# EAGLE design tiny-ui (EAGLE 5.10)
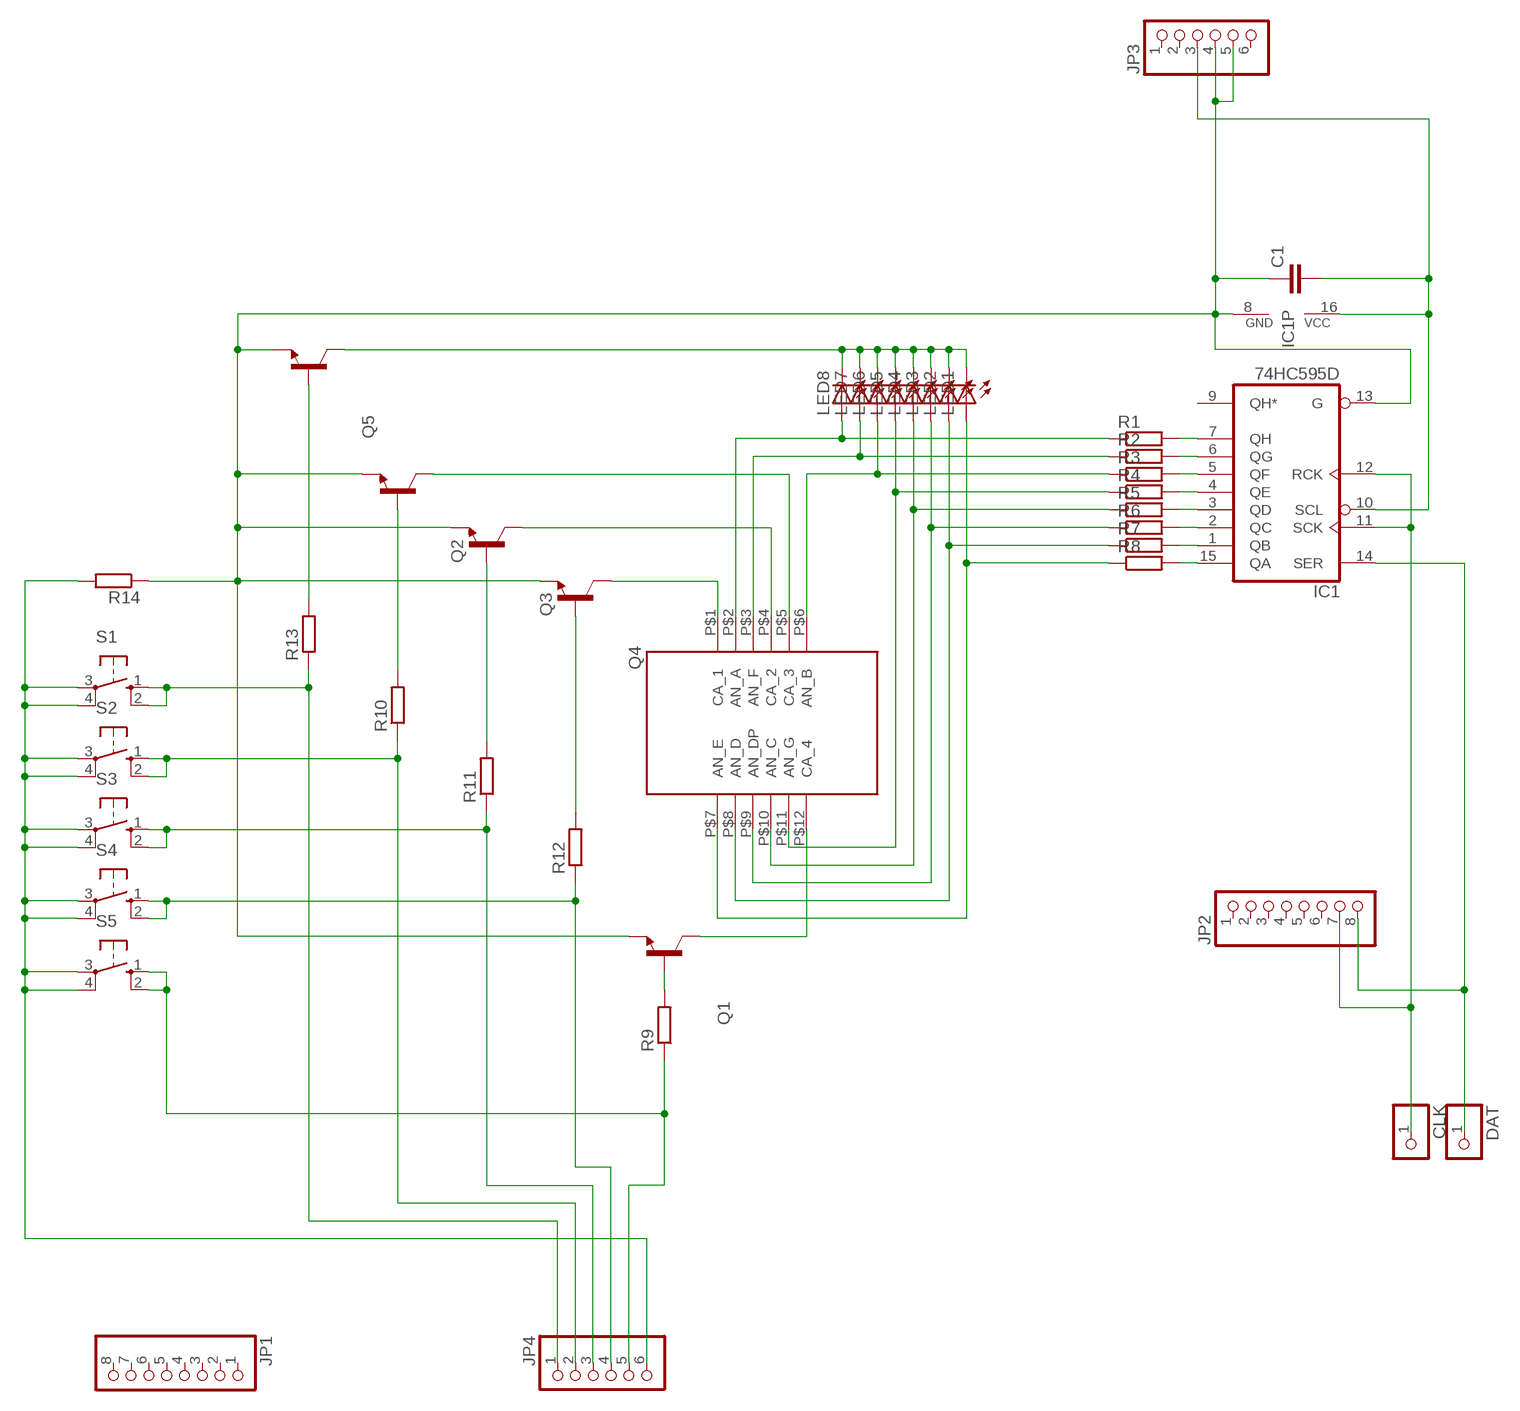
[diagram p0: schematic, sheet 1]

## Parts
C1  C-EUC0805  [C0805]
CLK  HEADER-1X1  [1X01_OVAL]
DAT  HEADER-1X1  [1X01_OVAL]
DISP1  QUAD7SEG  [QUAD7SEG]
IC1  74HC595D  [SO16]
JP1  PINHD-1X8  [1X08]
JP2  PINHD-1X8  [1X08]
JP3  PINHD-1X6  [1X06]
JP4  PINHD-1X6  [1X06]
LED1  LED3MM  [LED3MM]
LED2  LED3MM  [LED3MM]
LED3  LED3MM  [LED3MM]
LED4  LED3MM  [LED3MM]
LED5  LED3MM  [LED3MM]
LED6  LED3MM  [LED3MM]
LED7  LED3MM  [LED3MM]
LED8  LED3MM  [LED3MM]
Q1  MMBT2222ALT1-NPN-SOT23-BEC  [SOT23-BEC]
Q2  MMBT2222ALT1-NPN-SOT23-BEC  [SOT23-BEC]
Q3  MMBT2222ALT1-NPN-SOT23-BEC  [SOT23-BEC]
Q4  MMBT2222ALT1-NPN-SOT23-BEC  [SOT23-BEC]
Q5  MMBT2222ALT1-NPN-SOT23-BEC  [SOT23-BEC]
R1  R-EU_R0805  [R0805]
R2  R-EU_R0805  [R0805]
R3  R-EU_R0805  [R0805]
R4  R-EU_R0805  [R0805]
R5  R-EU_R0805  [R0805]
R6  R-EU_R0805  [R0805]
R7  R-EU_R0805  [R0805]
R8  R-EU_R0805  [R0805]
R9  R-EU_R0805  [R0805]
R10  R-EU_R0805  [R0805]
R11  R-EU_R0805  [R0805]
R12  R-EU_R0805  [R0805]
R13  R-EU_R0805  [R0805]
R14  R-EU_R0805  [R0805]
S1  10-XX  [B3F-10XX]
S2  10-XX  [B3F-10XX]
S3  10-XX  [B3F-10XX]
S4  10-XX  [B3F-10XX]
S5  10-XX  [B3F-10XX]

## Nets
GND: C1.1 IC1.8(GND) IC1.13(G) JP3.4 JP3.5 Q1.E Q2.E Q3.E Q4.E Q5.E R14.1
N$1: IC1.7(QH) R1.2
N$2: IC1.6(QG) R2.2
N$3: IC1.5(QF) R3.2
N$4: IC1.4(QE) R4.2
N$5: IC1.3(QD) R5.2
N$6: IC1.2(QC) R6.2
N$7: IC1.1(QB) R7.2
N$8: IC1.15(QA) R8.2
N$9: DISP1.P$2(AN_A) LED8.A R1.1
N$10: DISP1.P$3(AN_F) LED7.A R2.1
N$11: DISP1.P$6(AN_B) LED6.A R3.1
N$12: DISP1.P$11(AN_G) LED5.A R4.1
N$13: DISP1.P$10(AN_C) LED4.A R5.1
N$14: DISP1.P$9(AN_DP) LED3.A R6.1
N$15: DISP1.P$8(AN_D) LED2.A R7.1
N$16: DISP1.P$7(AN_E) LED1.A R8.1
N$17: LED1.K(C) LED2.K(C) LED3.K(C) LED4.K(C) LED5.K(C) LED6.K(C) LED7.K(C) LED8.K(C) Q5.C
N$18: DISP1.P$1(CA_1) Q4.C
N$19: DISP1.P$4(CA_2) Q3.C
N$20: DISP1.P$5(CA_3) Q2.C
N$21: DISP1.P$12(CA_4) Q1.C
N$22: Q5.B R13.2
N$23: Q2.B R10.2
N$24: Q3.B R11.2
N$25: Q4.B R12.2
N$26: Q1.B R9.2
N$28: CLK.1 IC1.11(SCK) IC1.12(RCK) JP2.7
N$31: JP4.1 R13.1 S1.1(S) S1.2(S1)
N$32: JP4.2 R10.1 S2.1(S) S2.2(S1)
N$33: JP4.3 R11.1 S3.1(S) S3.2(S1)
N$34: JP4.4 R12.1 S4.1(S) S4.2(S1)
N$35: JP4.6 R14.2 S1.3(P) S1.4(P1) S2.3(P) S2.4(P1) S3.3(P) S3.4(P1) S4.3(P) S4.4(P1) S5.3(P) S5.4(P1)
N$36: JP4.5 R9.1 S5.1(S) S5.2(S1)
N$37: DAT.1 IC1.14(SER) JP2.8
VCC: C1.2 IC1.10(SCL) IC1.16(VCC) JP3.3
Unconnected: IC1.9(QH*) JP1.1 JP1.2 JP1.3 JP1.4 JP1.5 JP1.6 JP1.7 JP1.8 JP2.1 JP2.2 JP2.3 JP2.4 JP2.5 JP2.6 JP3.1 JP3.2 JP3.6

## Library data of the parts
C1 = rcl:C-EU: CAPACITOR, European symbol
CLK DAT = microbuilder:HEADER-1X1: PIN HEADER
DISP1 = jasons_stuff:QUAD7SEG
IC1 = 74xx-eu:74*595: 8-bit SHIFT REGISTER, output latch
JP1 JP2 = pinhead:PINHD-1X8: PIN HEADER
JP3 JP4 = pinhead:PINHD-1X6: PIN HEADER
LED1-LED8 = adafruit:LED: LED OSRAM: - CHIPLED LG R971, LG N971, LY N971, LG Q971, LY Q971, LO R971, LY R971 LH N974, LH R974 LS Q976, LO Q976, LY Q976 LO Q996 - Hyper CHIPLED LW Q18S LB Q993, LB Q99A, LB R99A - SideLED LS A670, LO A670, LY A670, LG A670, LP A670 LB A673, LV A673, LT A673, LW A673 LH A674 LY A675 LS A676, LA A676, LO A676, LY A676, LW A676 LS A679, LY A679, LG A679 - Hyper Micro SIDELED® LS Y876, LA Y876, LO Y876, LY Y876 LT Y87S - SmartLED LW L88C, LW L88S LB L89C, LB L89S, LG L890 LS L89K, LO L89K, LY L89K LS L896, LA L896, LO L896, LY L896 - TOPLED LS T670, LO T670, LY T670, LG T670, LP T670 LSG T670, LSP T670, LSY T670, LOP T670, LYG T670 LG T671, LOG T671, LSG T671 LB T673, LV T673, LT T673, LW T673 LH T674 LS T676, LA T676, LO T676, LY T676, LB T676, LH T676, LSB T676, LW T676 LB T67C, LV T67C, LT T67C, LS T67K, LO T67K, LY T67K, LW E67C LS E67B, LA E67B, LO E67B, LY E67B, LB E67C, LV E67C, LT E67C LW T67C LS T679, LY T679, LG T679 LS T770, LO T770, LY T770, LG T770, LP T770 LB T773, LV T773, LT T773, LW T773 LH T774 LS E675, LA E675, LY E675, LS T675 LS T776, LA T776, LO T776, LY T776, LB T776 LHGB T686 LT T68C, LB T68C - Hyper Mini TOPLED® LB M676 - Mini TOPLED Santana® LG M470 LS M47K, LO M47K, LY M47K Source: http://www.osram.convergy.de/
Q1-Q5 = transistor:*-NPN-: NPN Transistror BF959 corrected 2008.03.06
R1-R14 = rcl:R-EU_: RESISTOR, European symbol
S1-S5 = switch-omron:10-XX: OMRON SWITCH

## Board
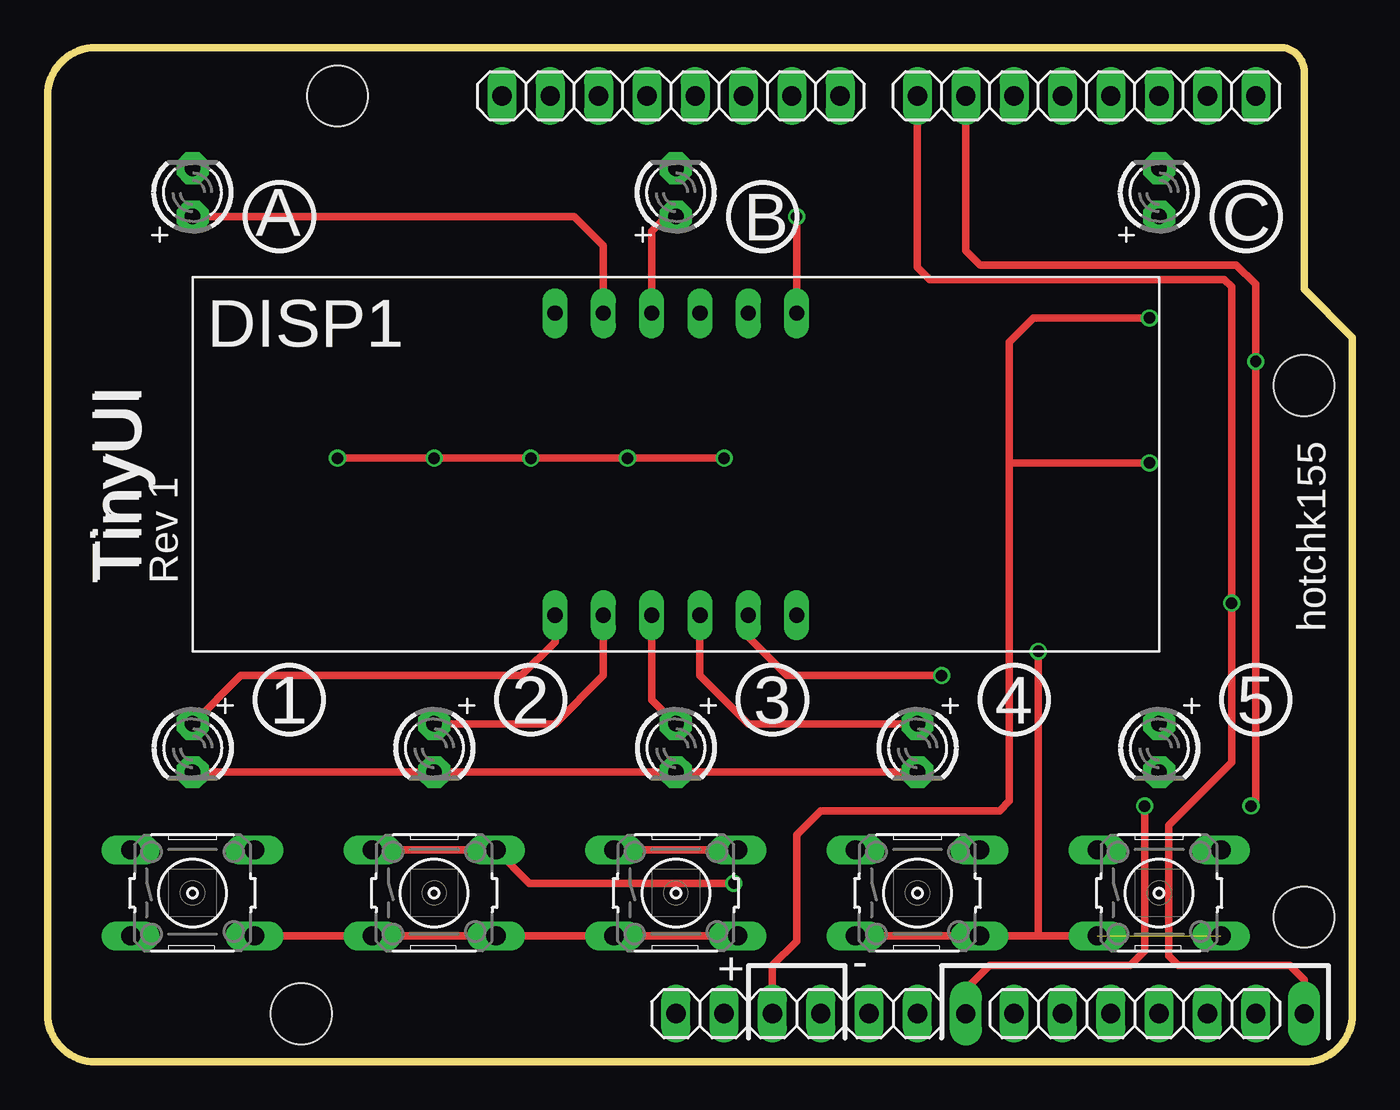
[diagram p1: board, top side]
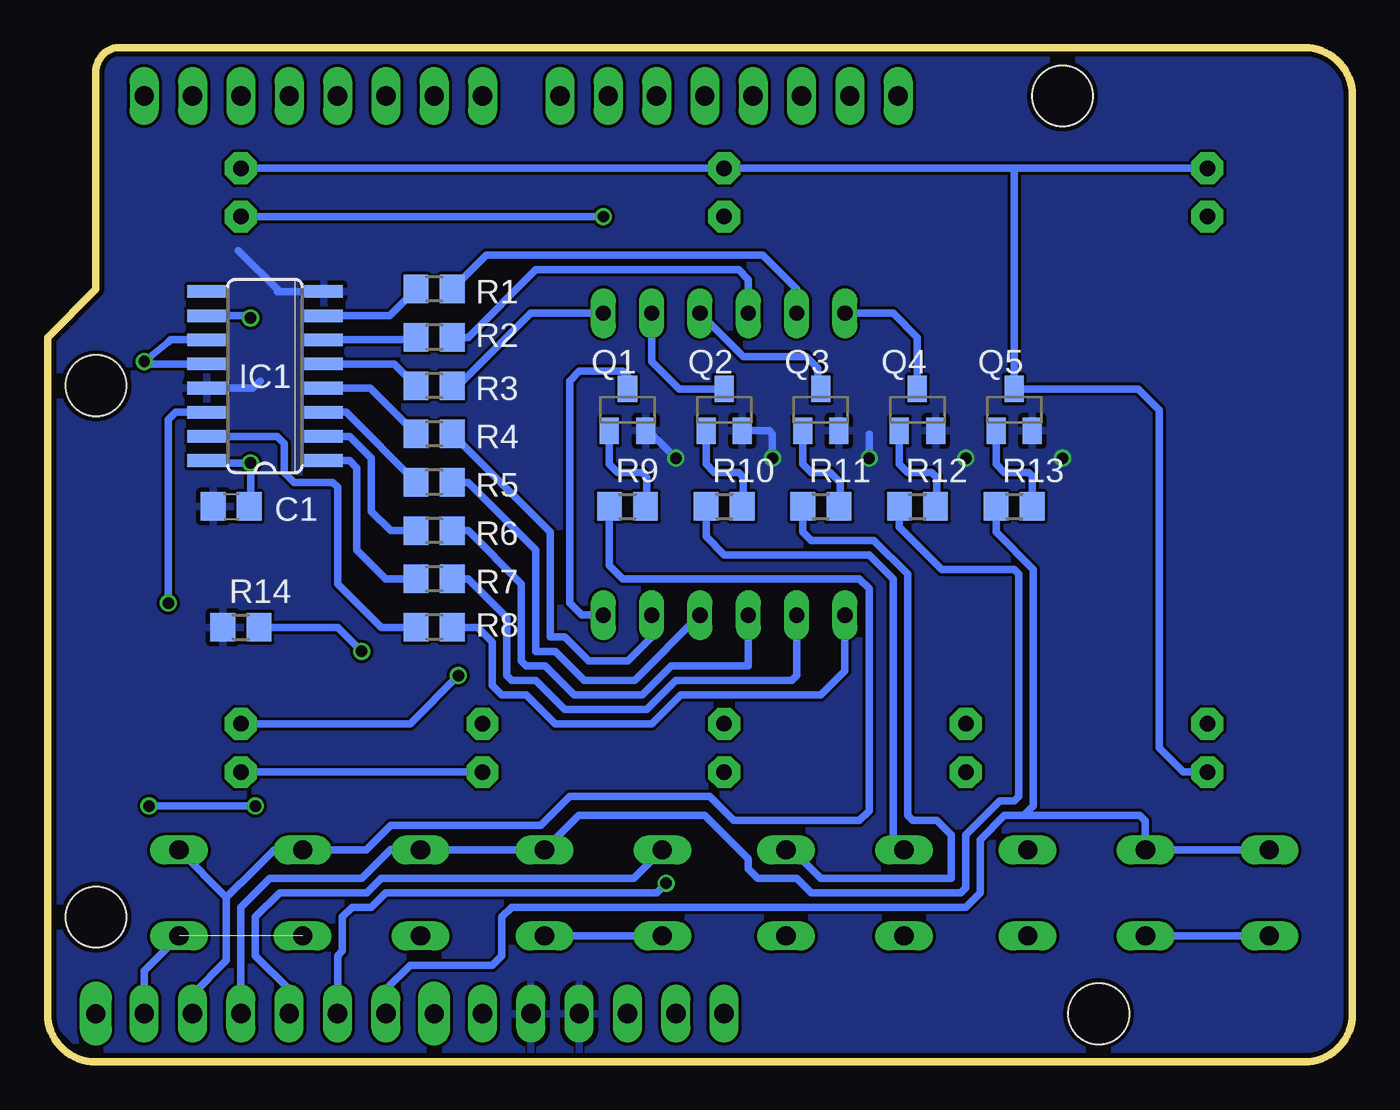
[diagram p2: board, bottom side, seen from below]

Size 68.58 x 53.34 mm. Coordinates in mm from the lower left corner, seen from the top.
Outline: 68.58,37.85 68.58,2.54
Outline: 68.58,2.54 68.58,38.1 66.04,40.64 66.04,52.07 arc90 64.77,53.34 2.54,53.34 arc90 0,50.8 0,2.54 arc90 2.54,0 66.04,0 arc90 68.58,2.54
Copper layers (1*16): Top 0.035mm / dielectric 1.5mm / Bottom 0.035mm
Design rules "ITEADstudio_DRC": minimum track width 6mil, minimum drill 12mil, track to track 6mil, track to pad 6mil, pad to pad 6mil, via to via 6mil, smd to smd 0mil, copper to edge 10mil, drill to drill 10mil, minimum pad ring 10mil, minimum via ring 6mil, stop-mask expansion 2mil, vias tented up to drill 100mil, thermal gap 10mil
Holes 3.2 mm at 15.24,50.8 66.04,35.56 66.04,7.62 13.34,2.54

### Footprints (pad centres in the part's own frame; a part is rotated, then mirrored left to right if it is on the bottom)
C0805 = smd 1.3 x 1.5: 1 -0.95,0; 2 0.95,0
1X01_OVAL = drill 1 pad 1.676 long: 1 0,0
QUAD7SEG = drill 0.8 long: P$1 -6.35,8.89; P$2 -3.81,8.89; P$3 -1.27,8.89; P$4 1.27,8.89; P$5 3.81,8.89; P$6 6.35,8.89; P$7 -6.35,-6.985; P$8 -3.81,-6.985; P$9 -1.27,-6.985; P$10 1.27,-6.985; P$11 3.81,-6.985; P$12 6.35,-6.985
SO16 = smd 0.66 x 2.032: 1 -4.445,-3.073; 2 -3.175,-3.073; 3 -1.905,-3.073; 4 -0.635,-3.073; 5 0.635,-3.073; 6 1.905,-3.073; 7 3.175,-3.073; 8 4.445,-3.073; 9 4.445,3.073; 10 3.175,3.073; 11 1.905,3.073; 12 0.635,3.073; 13 -0.635,3.073; 14 -1.905,3.073; 15 -3.175,3.073; 16 -4.445,3.073
1X08 = drill 1.016 long: 1 -8.89,0; 2 -6.35,0; 3 -3.81,0; 4 -1.27,0; 5 1.27,0; 6 3.81,0; 7 6.35,0; 8 8.89,0
1X06 = drill 1.016 long: 1 -6.35,0; 2 -3.81,0; 3 -1.27,0; 4 1.27,0; 5 3.81,0; 6 6.35,0
LED3MM = drill 0.813 pad 1.676 octagon: A -1.27,0; K 1.27,0
SOT23-BEC = smd 1 x 1.4: B -0.95,-1.1; C 0,1.1; E 0.95,-1.1
R0805 = smd 1.3 x 1.5: 1 -0.95,0; 2 0.95,0
B3F-10XX = drill 1.016 long: 1 -3.251,2.261; 2 3.251,2.261; 3 -3.251,-2.261; 4 3.251,-2.261

### Placement (x,y rotation side)
C1  58.93,29.21 0 bottom
CLK  48.26,2.54 0 top
DAT  66.04,2.54 0 top
DISP1  33.02,30.48 0 top
IC1  57.15,36.07 90 bottom
JP1  32.77,50.8 180 top
JP2  54.61,50.8 180 top
JP3  39.37,2.54 0 top
JP4  57.15,2.54 0 top
LED1  7.62,16.51 270 top
LED2  20.32,16.51 270 top
LED3  33.02,16.51 270 top
LED4  45.72,16.51 270 top
LED5  58.42,16.51 270 top
LED6  58.42,45.72 90 top
LED7  33.02,45.72 90 top
LED8  7.62,45.72 90 top
Q1  38.1,34.29 0 bottom
Q2  33.02,34.29 0 bottom
Q3  27.94,34.29 0 bottom
Q4  22.86,34.29 0 bottom
Q5  17.78,34.29 0 bottom
R1  48.26,40.64 180 bottom
R2  48.26,38.1 180 bottom
R3  48.26,35.56 180 bottom
R4  48.26,33.02 180 bottom
R5  48.26,30.48 180 bottom
R6  48.26,27.94 180 bottom
R7  48.26,25.4 180 bottom
R8  48.26,22.86 180 bottom
R9  38.1,29.21 0 bottom
R10  33.02,29.21 0 bottom
R11  27.94,29.21 0 bottom
R12  22.86,29.21 0 bottom
R13  17.78,29.21 0 bottom
R14  58.42,22.86 0 bottom
S1  7.62,8.89 0 top
S2  20.32,8.89 0 top
S3  33.02,8.89 0 top
S4  45.72,8.89 0 top
S5  58.42,8.89 0 top

### Tracks (layer width: path | path; a pad name or v marks a point on that pad's centre or on a via)
GND  (via drill 0.6)
  Top 0.406: v35.56,31.75 v30.48,31.75 v25.4,31.75 v15.24,31.75 v20.32,31.75
  Bottom 0.406: 56.39,40.51 56.52,40.51 | IC1.8 56.39,40.51 | IC1.13 57.78,35.43 57.4,35.81 | 56.39,40.51 58.55,42.67 | Q2.E 30.65,33.19 30.48,33.02 v30.48,31.75 | v25.4,31.75 25.4,33.02 | Q1.E 37,33.19 v35.56,31.75
  pour Bottom: 0,53.34 0,0 66.04,0 68.58,2.54 68.58,38.1 66.04,40.64 66.04,52.07 64.77,53.34
N$1
  Bottom 0.406: IC1.7 50.61,39.24 R1.2
N$2
  Bottom 0.406: IC1.6 49.34,37.97 R2.2
N$3
  Bottom 0.406: IC1.5 50.35,36.7 R3.2
N$4
  Bottom 0.406: IC1.4 51.62,35.43 R4.2
N$5
  Bottom 0.406: IC1.3 52.89,34.16 R5.2
N$6
  Bottom 0.406: IC1.2 52.7,32.89 51.56,31.75 51.56,28.96 50.55,27.94 R6.2
N$7
  Bottom 0.406: IC1.1 52.7,31.62 52.32,31.24 52.32,26.92 50.8,25.4 R7.2
N$8
  Bottom 0.406: R8.2 51.05,22.86 53.34,25.15 53.34,30.23 53.59,30.48 55.63,30.48 56.13,30.99 56.13,32.51 56.52,32.89 IC1.15
N$9
  Top 0.406: LED8.A 27.69,44.45 29.21,42.93 DISP1.P$2
  Bottom 0.406: DISP1.P$2 29.21,40.64 30.99,42.42 45.53,42.42 R1.1 46.99,40.96
N$10
  Top 0.406: LED7.A 32.51,44.45 31.75,43.69 DISP1.P$3
  Bottom 0.406: R2.1 46.48,38.1 42.93,41.66 32.26,41.66 31.75,41.15 DISP1.P$3
N$11  (via drill 0.6)
  Top 0.406: DISP1.P$6 v39.37,44.45
  Bottom 0.406: R3.1 46.99,35.56 43.18,39.37 DISP1.P$6 | v39.37,44.45 LED6.A
N$12  (via drill 0.6)
  Top 0.406: DISP1.P$11 36.83,22.35 38.86,20.32 v46.99,20.32
  Bottom 0.406: DISP1.P$11 36.83,22.35 38.1,21.08 40.13,21.08 41.4,22.35 42.16,22.35 42.16,27.87 R4.1 | LED5.A 49.53,17.78 v46.99,20.32
N$13
  Top 0.406: LED4.A 40.64,17.78 40.01,17.78 36.83,17.78 34.29,20.32 DISP1.P$10
  Bottom 0.406: R5.1 46.48,30.48 42.93,26.92 42.93,21.59 41.91,21.59 40.39,20.07 37.72,20.07 DISP1.P$10
N$14
  Top 0.406: LED3.A 31.75,19.05 DISP1.P$9
  Bottom 0.406: DISP1.P$9 31.75,20.83 35.81,20.83 37.34,19.3 40.89,19.3 42.42,20.83 43.43,20.83 43.69,21.08 43.69,25.15 46.48,27.94 R6.1
N$15
  Top 0.406: DISP1.P$8 29.21,20.32 26.67,17.78 LED2.A
  Bottom 0.406: 46.99,25.4 R7.1 46.48,25.4 44.45,23.37 44.45,20.32 44.2,20.07 42.93,20.07 41.4,18.54 37.08,18.54 35.56,20.07 29.46,20.07 29.21,20.32 DISP1.P$8
N$16
  Top 0.406: DISP1.P$7 26.67,22.1 24.89,20.32 10.16,20.32 LED1.A
  Bottom 0.406: R8.1 45.97,22.86 45.21,22.1 45.21,19.81 44.7,19.3 43.43,19.3 41.91,17.78 36.83,17.78 35.31,19.3 27.94,19.3 26.67,20.57 DISP1.P$7
N$17
  Top 0.406: LED1.K LED2.K LED3.K LED4.K
  Bottom 0.406: 17.78,46.99 LED8.K | 17.78,46.99 LED7.K LED6.K | 17.78,46.99 Q5.C 11.26,35.39 10.16,34.29 10.16,16.51 8.89,15.24 LED1.K | LED4.K LED5.K
N$18
  Bottom 0.406: DISP1.P$1 24.13,39.37 22.86,38.1 Q4.C
N$19
  Bottom 0.406: 34.29,39.12 DISP1.P$4 32,37.08 28.7,37.08 28.11,36.49 28.11,35.56 Q3.C
N$20
  Bottom 0.406: 36.83,38.35 DISP1.P$5 36.83,36.83 35.39,35.39 Q2.C
N$21
  Bottom 0.406: DISP1.P$12 40.51,23.5 41.15,24.13 41.15,35.81 40.64,36.32 38.35,36.32 38.1,36.07 Q1.C
N$22
  Bottom 0.406: Q5.B 18.73,31.43 18.29,30.99 17.02,30.99 16.83,30.8 R13.2
N$23
  Bottom 0.406: Q2.B 33.97,31.43 33.53,30.99 32.26,30.99 32,30.73 32,29.28 R10.2
N$24
  Bottom 0.406: Q3.B 28.89,31.43 28.45,30.99 27.43,30.99 26.92,30.48 26.92,29.28 R11.2
N$25
  Bottom 0.406: Q4.B 23.81,31.43 23.37,30.99 22.1,30.99 21.84,30.73 21.84,29.28 R12.2
N$26
  Bottom 0.406: Q1.B 39.05,31.43 38.61,30.99 37.34,30.99 37.08,30.73 37.08,29.28 R9.2
N$28  (via drill 0.6)
  Top 0.406: CLK.1 48.26,3.81 49.53,5.08 56.9,5.08 57.66,5.84 v57.66,13.46 | v63.25,13.46 63.5,13.72 v63.5,36.83 63.5,40.89 62.48,41.91 49.02,41.91 48.26,42.67 JP2.7
  Bottom 0.406: IC1.12 63.37,36.7 v63.5,36.83 62.23,37.85 62.1,37.97 IC1.11 | v57.66,13.46 v63.25,13.46
N$31
  Bottom 0.406: JP4.1 50.8,3.81 49.53,5.08 45.21,5.08 44.7,5.59 44.7,7.62 44.2,8.13 20.32,8.13 19.56,8.89 19.56,11.68 18.29,12.95 17.27,12.95 | R13.1 18.73,27.87 16.76,25.91 16.76,13.46 17.27,12.95 | S1.1 S1.2 10.9,11.18 10.9,12.68 11.18,12.95 17.27,12.95
N$32  (via drill 0.6)
  Top 0.406: v36.07,9.4 25.32,9.4 S2.2 S2.1
  Bottom 0.406: 23.88,11.46 S2.2 24.13,11.71 24.13,25.4 25.4,26.67 33.02,26.67 33.97,27.62 R10.1 | v36.07,9.4 36.58,8.89 50.8,8.89 51.56,8.13 52.58,8.13 53.09,7.62 53.09,5.84 53.34,5.59 JP4.2
N$33
  Top 0.406: S3.1 S3.2
  Bottom 0.406: JP4.3 55.88,3.81 57.66,5.59 57.66,7.62 56.39,8.89 51.82,8.89 51.05,9.65 37.77,9.65 S3.2 | S3.1 29.74,11.18 29.46,11.18 27.94,9.65 21.08,9.65 21.08,11.94 21.84,12.7 23.11,12.7 23.37,12.95 23.37,25.65 25.15,27.43 28.45,27.43 28.89,27.87 R11.1
N$34
  Bottom 0.406: JP4.4 58.42,8.13 56.9,9.65 52.07,9.65 50.55,11.18 49,11.18 S4.2 S4.1 40.66,12.95 34.04,12.95 31.75,10.67 31.75,10.16 31.24,9.65 29.21,9.65 28.45,8.89 20.57,8.89 20.32,9.14 20.32,11.94 18.54,13.72 17.78,13.72 17.53,13.97 17.53,25.65 17.78,25.91 21.59,25.91 23.81,28.13 R12.1
N$35  (via drill 0.6)  (1 unrouted)
  Top 0.406: 52.07,6.63 S4.4 S4.3 | 52.07,6.63 S5.3 | S1.4 S2.3 S2.4 S3.3 S3.4 | 52.07,6.63 v52.07,21.59
  Bottom 0.406: JP4.6 63.5,4.8 S5.4 | S3.4 S4.3 | S1.3 S1.4 | R14.2 53.34,22.86 v52.07,21.59
N$36
  Bottom 0.406: JP4.5 60.96,3.56 59.18,5.33 59.18,8.66 | 59.18,8.66 S5.2 | R9.1 39.05,26.1 38.35,25.4 25.91,25.4 25.4,24.89 25.4,13.21 25.91,12.7 32.51,12.7 33.78,13.97 41.15,13.97 42.67,12.45 50.55,12.45 51.84,11.15 S5.1 56.67,11.15 58.42,9.4 58.45,9.4 59.18,8.66
N$37  (via drill 0.6)
  Top 0.406: DAT.1 66.04,4.32 65.28,5.08 59.44,5.08 58.93,5.59 58.93,12.45 62.23,15.75 v62.23,24.13 62.23,40.77 61.85,41.15 46.35,41.15 45.72,41.78 JP2.8
  Bottom 0.406: IC1.14 61.85,34.16 62.23,33.78 v62.23,24.13
VCC  (via drill 0.6)
  Top 0.406: v57.91,39.12 51.82,39.12 50.55,37.85 50.55,31.5 | 50.55,31.5 50.55,13.72 50.04,13.21 40.64,13.21 39.37,11.94 39.37,6.35 38.1,5.08 JP3.3 | 50.55,31.5 v57.91,31.5
  Bottom 0.406: IC1.10 58.04,39.24 v57.91,39.12 | IC1.16 60.1,31.5 v57.91,31.5 57.91,29.28 C1.2

### Text on the board
tNames: A | B | C | hotchk155 | TinyUI | TinyUI | Rev 1 | 1 | 2 | 3 | 4 | 5 | + | -